# Altium schematic sheet MX8M-Nano-USB.SchDoc
size A; SheetNumber: 5; SheetTotal: 16
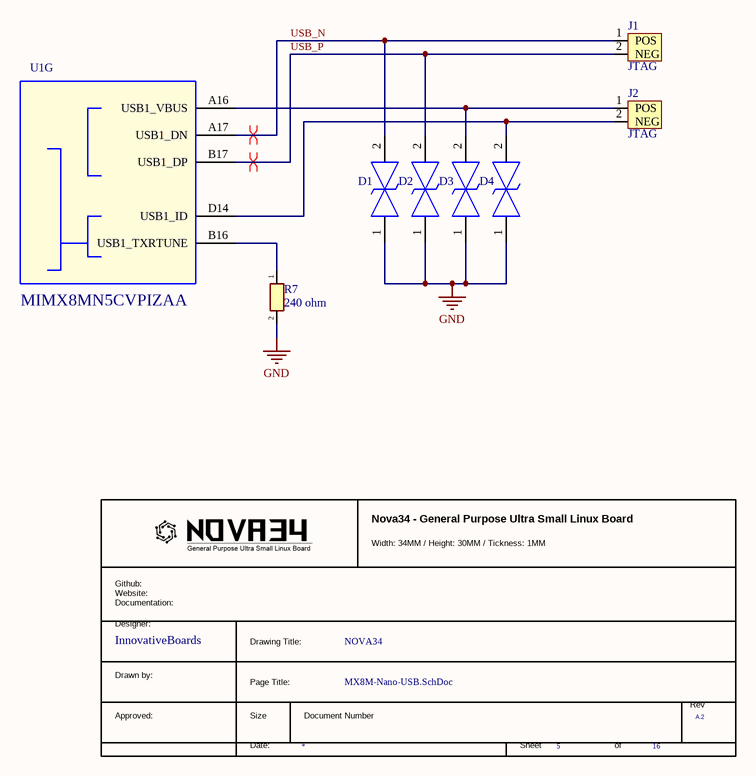
[diagram p0: MX8M-Nano-USB.SchDoc]

## Parts
*  RevCode: A.2  (hidden comment: TitleBlock_MCPG)  (graphical)
D1  TVS Diode  [SODFL1608X77N]  (value not drawn)
D2  TVS Diode  [SODFL1608X77N]  (value not drawn)
D3  TVS Diode  [SODFL1608X77N]  (value not drawn)
D4  TVS Diode  [SODFL1608X77N]  (value not drawn)
J1  JTAG  [JTAG]
J2  JTAG  [JTAG]
R7  240 ohm  [RESC0603X26N]
U1  MIMX8MN5CVPIZAA  [BGA306C50P21X21_1100X1100X101]  (part G of 12)

## Nets
GND: D1.1 D2.1 D3.1 D4.1 R7.2
USB_N: D1.2 J1.1(POS) U1.A17(USB1_DN)
USB_P: D2.2 J1.2(NEG) U1.B17(USB1_DP)
NetD3_2: D3.2 J2.1(POS) U1.A16(USB1_VBUS)
NetD4_2: D4.2 J2.2(NEG) U1.D14(USB1_ID)
NetR7_1: R7.1 U1.B16(USB1_TXRTUNE)

## Layout directives
differential pair: USB_N, USB_P

## Notes on the sheet
- (in symbol TitleBlock_MCPG) Nova34 - General Purpose Ultra Small Linux Board; Width: 34MM / Height: 30MM / Tickness: 1MM; Github: / Website: / Documentation:; Designer:; InnovativeBoards; Drawing Title:; NOVA34; Drawn by:; Page Title:; Rev; Approved:; Size; Document Number; Date:; Sheet; of

## Library data of the parts
D1-D4 = TPD1E10B06DYAR: TVS Diode (Bi-directional); Manufacturer_Name: Texas Instruments; Datasheet Link: https://www.ti.com/lit/ds/symlink/tpd1e10b06.pdf?ts=1676259025619&ref_url=https%253A%252F%252Fwww.ti.com%252Fproduct%252FTPD1E10B06%252Fpart-details%252FTPD1E10B06DYAR; Height: 0.77mm; Manufacturer_Part_Number: TPD1E10B06DYAR; Mouser Part Number: 595-TPD1E10B06DYAR; Mouser Price/Stock: https://www.mouser.co.uk/ProductDetail/Texas-Instruments/TPD1E10B06DYAR?qs=Rp5uXu7WBW9%2F66n97S3Kgw%3D%3D; Arrow Part Number: TPD1E10B06DYAR; Arrow Price/Stock: https://www.arrow.com/en/products/tpd1e10b06dyar/texas-instruments?utm_currency=USD&region=nac
R7 = RC0201FR-07240RL: Resistor; Manufacturer_Name: KEMET; Datasheet Link: http://www.yageo.com/documents/recent/PYu-RC0201_51_RoHS_L_8.pdf; Height: 0.26mm; Manufacturer_Part_Number: RC0201FR-07240RL; Mouser Part Number: 603-RC0201FR-07240RL; Mouser Price/Stock: http://www.mouser.com/Search/ProductDetail.aspx?qs=qUsL5DZkYVqW175bPUdS2w%3d%3d; Arrow Part Number: RC0201FR-07240RL; Arrow Price/Stock: https://www.arrow.com/en/products/rc0201fr-07240rl/yageo
U1 = MIMX8MN: IC CPU QUAD CORTEX A53+M7 1.4GHZ -- BGA306; PCB Footprint: pbga306_0p5_sq11mm; AGILE_PN: TMP-CIP-5098; CAD_APPROVED: Yes; PRE_APN: 330-77152; Temp Range: -40¡ãC to 105¡ãC; MFG_NAME01: NXP SEMICONDUCTORS; CLASS: IC; HEIGHT: 1.01MM; ROHS: Yes; MFG_PN01: MIMX8MN5CVPIZAA
* = TitleBlock_MCPG: Page Create Date: March  8, 1995